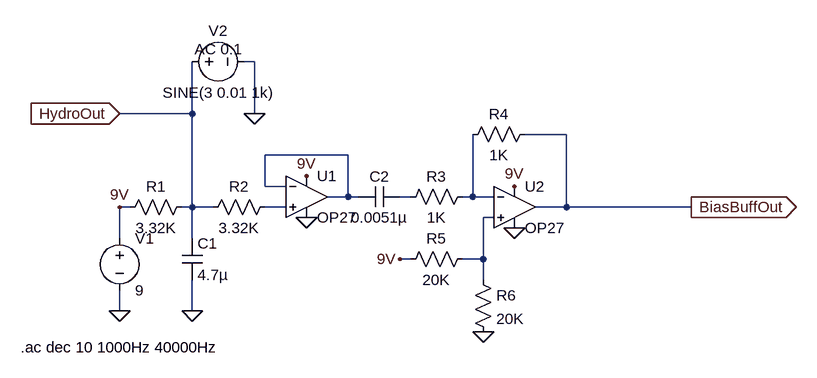
[diagram p0: schematic BiasBuffer.asc]
BiasBuffer.asc, the LTspice schematic file:
Version 4
SHEET 1 1096 680
WIRE 224 -288 208 -288
WIRE 128 -208 128 -288
WIRE 128 -208 16 -208
WIRE 224 -208 224 -288
WIRE 704 -176 640 -176
WIRE 368 -144 240 -144
WIRE 240 -96 240 -144
WIRE 272 -96 240 -96
WIRE 368 -80 368 -144
WIRE 368 -80 336 -80
WIRE 384 -80 368 -80
WIRE 464 -80 448 -80
WIRE 560 -80 560 -176
WIRE 560 -80 544 -80
WIRE 592 -80 560 -80
WIRE 32 -64 16 -64
WIRE 128 -64 128 -208
WIRE 128 -64 112 -64
WIRE 160 -64 128 -64
WIRE 272 -64 240 -64
WIRE 704 -64 704 -176
WIRE 704 -64 656 -64
WIRE 896 -64 704 -64
WIRE 592 -48 576 -48
WIRE 16 -16 16 -64
WIRE 128 -16 128 -64
WIRE 464 16 448 16
WIRE 576 16 576 -48
WIRE 576 16 544 16
WIRE 576 48 576 16
WIRE 16 96 16 64
WIRE 128 96 128 48
FLAG 16 96 0
FLAG 128 96 0
FLAG 448 16 9V
FLAG 16 -64 9V
FLAG 576 128 0
FLAG 16 -208 HydroOut
IOPIN 16 -208 In
FLAG 896 -64 BiasBuffOut
IOPIN 896 -64 Out
FLAG 224 -208 0
FLAG 304 -48 0
FLAG 624 -32 0
FLAG 304 -112 9V
FLAG 624 -96 9V
SYMBOL voltage 16 -32 R0
WINDOW 123 0 0 Left 0
WINDOW 39 0 0 Left 0
SYMATTR InstName V1
SYMATTR Value 9
SYMBOL cap 112 -16 R0
SYMATTR InstName C1
SYMATTR Value 4.7µ
SYMATTR SpiceLine V=10 Irms=0 Rser=0.003 Lser=0 mfg="TDK" pn="C3216X5RlA475M" type="X5R"
SYMBOL res 128 -80 R90
WINDOW 0 0 56 VBottom 2
WINDOW 3 32 56 VTop 2
SYMATTR InstName R1
SYMATTR Value 3.32K
SYMATTR SpiceLine tol=1 pwr=0.1
SYMBOL res 256 -80 R90
WINDOW 0 0 56 VBottom 2
WINDOW 3 32 56 VTop 2
SYMATTR InstName R2
SYMATTR Value 3.32K
SYMATTR SpiceLine tol=1 pwr=0.1
SYMBOL Opamps\\OP27 304 -144 R0
SYMATTR InstName U1
SYMBOL cap 448 -96 R90
WINDOW 0 0 32 VBottom 2
WINDOW 3 32 32 VTop 2
SYMATTR InstName C2
SYMATTR Value 0.0051µ
SYMATTR SpiceLine V=50 Irms=0 Rser=0 Lser=0 mfg="Murata" pn="GCM1885C1H512JA16" type="C0G"
SYMBOL res 560 -96 R90
WINDOW 0 0 56 VBottom 2
WINDOW 3 32 56 VTop 2
SYMATTR InstName R3
SYMATTR Value 1K
SYMATTR SpiceLine tol=1 pwr=0.1
SYMBOL Opamps\\OP27 624 -128 R0
SYMATTR InstName U2
SYMBOL res 656 -192 R90
WINDOW 0 0 56 VBottom 2
WINDOW 3 32 56 VTop 2
SYMATTR InstName R4
SYMATTR Value 1K
SYMATTR SpiceLine tol=1 pwr=0.1
SYMBOL res 560 0 R90
WINDOW 0 0 56 VBottom 2
WINDOW 3 32 56 VTop 2
SYMATTR InstName R5
SYMATTR Value 20K
SYMATTR SpiceLine tol=1 pwr=0.1
SYMBOL res 560 32 R0
SYMATTR InstName R6
SYMATTR Value 20K
SYMATTR SpiceLine tol=1 pwr=0.1
SYMBOL voltage 112 -288 R270
WINDOW 0 32 56 VTop 2
WINDOW 3 -32 56 VBottom 2
WINDOW 123 4 56 VTop 2
WINDOW 39 0 0 Left 0
SYMATTR InstName V2
SYMATTR Value SINE(3 0.01 1k)
SYMATTR Value2 AC 0.1
TEXT -136 152 Left 2 !.ac dec 10 1000Hz 40000Hz

The netlist it stands for:
* BiasBuffer.asc
V1 9V 0 9
C1 HydroOut 0 4.7µ V=10 Irms=0 Rser=0.003 Lser=0 mfg="TDK" pn="C3216X5RlA475M" type="X5R"
R1 HydroOut 9V 3.32K tol=1 pwr=0.1
R2 N004 HydroOut 3.32K tol=1 pwr=0.1
XU1 N004 N001 9V 0 N001 OP27  ; pins In+ In- V+ V- OUT
C2 N002 N001 0.0051µ V=50 Irms=0 Rser=0 Lser=0 mfg="Murata" pn="GCM1885C1H512JA16" type="C0G"
R3 N003 N002 1K tol=1 pwr=0.1
XU2 N005 N003 9V 0 BiasBuffOut OP27  ; pins In+ In- V+ V- OUT
R4 BiasBuffOut N003 1K tol=1 pwr=0.1
R5 N005 9V 20K tol=1 pwr=0.1
R6 N005 0 20K tol=1 pwr=0.1
V2 HydroOut 0 SINE(3 0.01 1k) AC 0.1
.ac dec 10 1000Hz 40000Hz
.lib ADI.lib
.backanno
.end